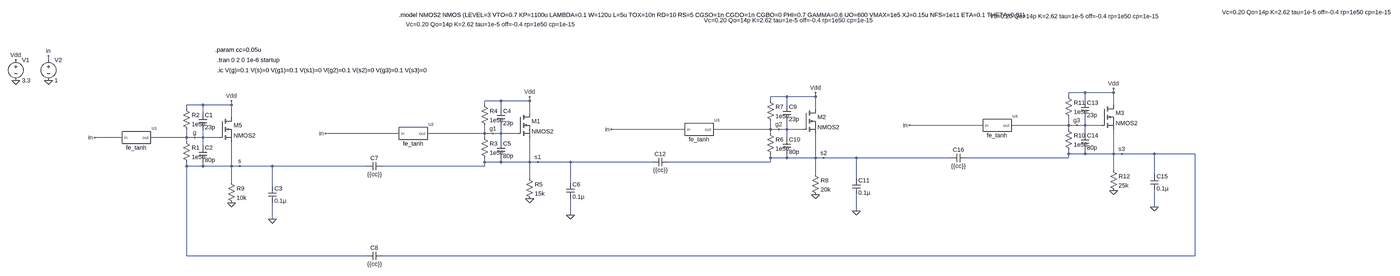
[diagram p0: schematic Oscilador_coupled_transistors_single.asc, whole sheet]
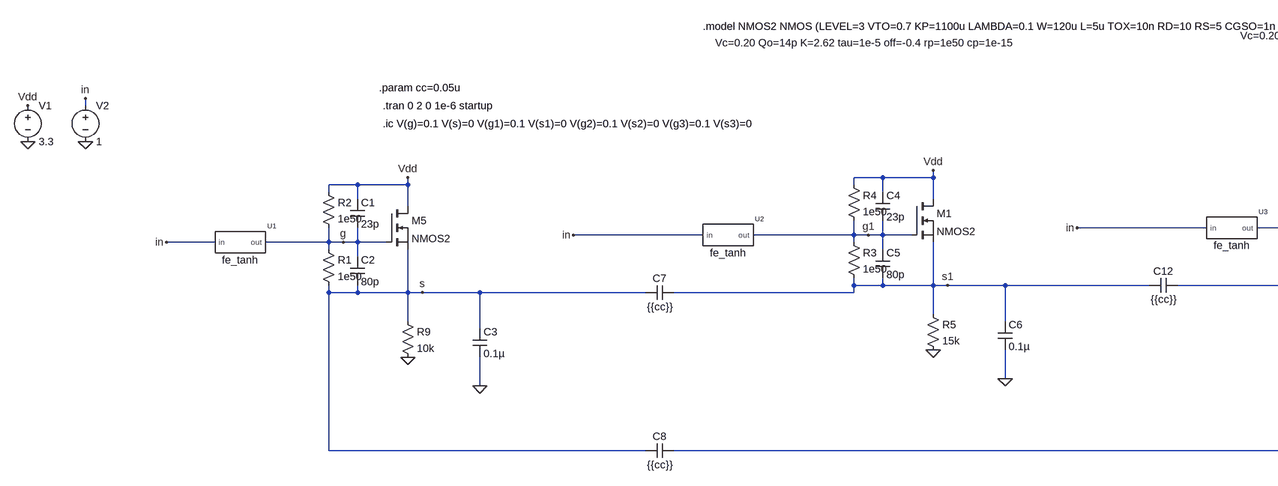
[diagram p1: schematic Oscilador_coupled_transistors_single.asc, part, row 1 of 1, column 1 of 2]
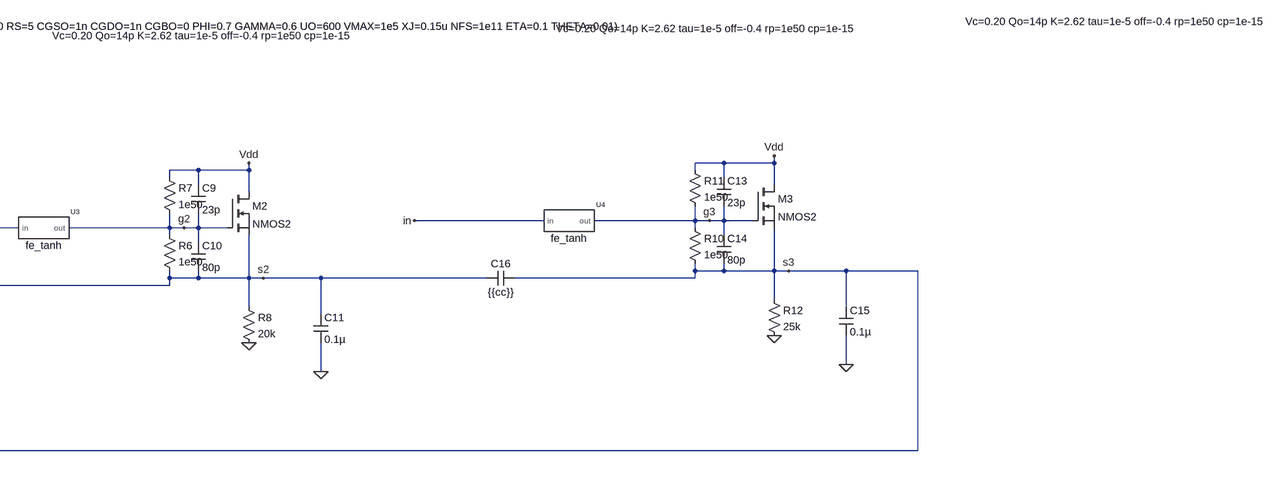
[diagram p2: schematic Oscilador_coupled_transistors_single.asc, part, row 1 of 1, column 2 of 2]
Oscilador_coupled_transistors_single.asc, the LTspice schematic file:
Version 4
SHEET 1 6256 2496
WIRE -384 -112 -384 -128
WIRE 4032 16 3968 16
WIRE 4144 16 4144 0
WIRE 4144 16 4032 16
WIRE 2864 32 2800 32
WIRE 2976 32 2976 16
WIRE 2976 32 2864 32
WIRE 3968 32 3968 16
WIRE 1744 48 1680 48
WIRE 1856 48 1856 32
WIRE 1856 48 1744 48
WIRE 2800 48 2800 32
WIRE 4032 48 4032 16
WIRE 576 64 512 64
WIRE 688 64 688 48
WIRE 688 64 576 64
WIRE 1680 64 1680 48
WIRE 2864 64 2864 32
WIRE 4144 64 4144 16
WIRE 512 80 512 64
WIRE 1744 80 1744 48
WIRE 2976 80 2976 32
WIRE 576 96 576 64
WIRE 1856 96 1856 48
WIRE 688 112 688 64
WIRE 3632 144 3344 144
WIRE 3968 144 3968 112
WIRE 3968 144 3744 144
WIRE 4000 144 3968 144
WIRE 4032 144 4032 112
WIRE 4032 144 4000 144
WIRE 4096 144 4032 144
WIRE 2464 160 2176 160
WIRE 2800 160 2800 128
WIRE 2800 160 2576 160
WIRE 2832 160 2800 160
WIRE 2864 160 2864 128
WIRE 2864 160 2832 160
WIRE 2928 160 2864 160
WIRE 3968 160 3968 144
WIRE 1344 176 1056 176
WIRE 1680 176 1680 144
WIRE 1680 176 1456 176
WIRE 1712 176 1680 176
WIRE 1744 176 1744 144
WIRE 1744 176 1712 176
WIRE 1808 176 1744 176
WIRE 2800 176 2800 160
WIRE 4032 176 4032 144
WIRE 176 192 -112 192
WIRE 512 192 512 160
WIRE 512 192 288 192
WIRE 544 192 512 192
WIRE 576 192 576 160
WIRE 576 192 544 192
WIRE 640 192 576 192
WIRE 1680 192 1680 176
WIRE 2864 192 2864 160
WIRE 512 208 512 192
WIRE 1744 208 1744 176
WIRE 576 224 576 192
WIRE 3968 256 3968 240
WIRE 4032 256 4032 240
WIRE 4032 256 3968 256
WIRE 4144 256 4144 160
WIRE 4144 256 4032 256
WIRE 4176 256 4144 256
WIRE 4304 256 4176 256
WIRE 4496 256 4304 256
WIRE 2800 272 2800 256
WIRE 2864 272 2864 256
WIRE 2864 272 2800 272
WIRE 2976 272 2976 176
WIRE 2976 272 2864 272
WIRE 3008 272 2976 272
WIRE 3136 272 3008 272
WIRE 3504 272 3136 272
WIRE 3968 272 3968 256
WIRE 3968 272 3568 272
WIRE 1680 288 1680 272
WIRE 1744 288 1744 272
WIRE 1744 288 1680 288
WIRE 1856 288 1856 192
WIRE 1856 288 1744 288
WIRE 1888 288 1856 288
WIRE 2016 288 1888 288
WIRE 2336 288 2016 288
WIRE 2800 288 2800 272
WIRE 2800 288 2400 288
WIRE 512 304 512 288
WIRE 576 304 576 288
WIRE 576 304 512 304
WIRE 688 304 688 208
WIRE 688 304 576 304
WIRE 720 304 688 304
WIRE 848 304 720 304
WIRE 1216 304 848 304
WIRE 1680 304 1680 288
WIRE 1680 304 1280 304
WIRE 4144 320 4144 256
WIRE 2976 336 2976 272
WIRE 4304 336 4304 256
WIRE 1856 352 1856 288
WIRE 3136 352 3136 272
WIRE 688 368 688 304
WIRE 2016 368 2016 288
WIRE 848 384 848 304
WIRE 4304 464 4304 400
WIRE 3136 480 3136 416
WIRE 2016 496 2016 432
WIRE 848 512 848 448
WIRE 512 656 512 304
WIRE 1216 656 512 656
WIRE 4496 656 4496 256
WIRE 4496 656 1280 656
FLAG -512 -32 0
FLAG -512 -112 Vdd
FLAG 688 48 Vdd
FLAG 848 512 0
FLAG -384 -32 0
FLAG -112 192 in
FLAG -384 -128 in
FLAG 544 192 g
FLAG 720 304 s
FLAG 688 448 0
FLAG 1856 32 Vdd
FLAG 2016 496 0
FLAG 1056 176 in
FLAG 1712 176 g1
FLAG 1888 288 s1
FLAG 1856 432 0
FLAG 2976 16 Vdd
FLAG 3136 480 0
FLAG 2176 160 in
FLAG 2832 160 g2
FLAG 3008 272 s2
FLAG 2976 416 0
FLAG 4144 0 Vdd
FLAG 4304 464 0
FLAG 3344 144 in
FLAG 4000 144 g3
FLAG 4176 256 s3
FLAG 4144 400 0
SYMBOL voltage -512 -128 R0
WINDOW 123 0 0 Left 0
WINDOW 39 0 0 Left 0
SYMATTR InstName V1
SYMATTR Value 3.3
SYMBOL cap 560 96 R0
SYMATTR InstName C1
SYMATTR Value 23p
SYMBOL cap 560 224 R0
SYMATTR InstName C2
SYMATTR Value 80p
SYMBOL res 496 192 R0
SYMATTR InstName R1
SYMATTR Value 1e50
SYMBOL res 496 64 R0
SYMATTR InstName R2
SYMATTR Value 1e50
SYMBOL cap 832 384 R0
SYMATTR InstName C3
SYMATTR Value 0.1µ
SYMBOL voltage -384 -128 R0
WINDOW 123 0 0 Left 0
WINDOW 39 0 0 Left 0
SYMATTR InstName V2
SYMATTR Value 1
SYMBOL fe_tanh 224 192 R0
WINDOW 39 1480 -459 Top 2
SYMATTR SpiceLine Vc=0.20 Qo=14p K=2.62 tau=1e-5 off=-0.4 rp=1e50 cp=1e-15
SYMATTR InstName U1
SYMBOL nmos 640 112 R0
SYMATTR InstName M5
SYMATTR Value NMOS2
SYMBOL res 672 352 R0
SYMATTR InstName R9
SYMATTR Value 10k
SYMBOL cap 1728 80 R0
SYMATTR InstName C4
SYMATTR Value 23p
SYMBOL cap 1728 208 R0
SYMATTR InstName C5
SYMATTR Value 80p
SYMBOL res 1664 176 R0
SYMATTR InstName R3
SYMATTR Value 1e50
SYMBOL res 1664 48 R0
SYMATTR InstName R4
SYMATTR Value 1e50
SYMBOL cap 2000 368 R0
SYMATTR InstName C6
SYMATTR Value 0.1µ
SYMBOL fe_tanh 1392 176 R0
WINDOW 39 1480 -459 Top 2
SYMATTR SpiceLine Vc=0.20 Qo=14p K=2.62 tau=1e-5 off=-0.4 rp=1e50 cp=1e-15
SYMATTR InstName U2
SYMBOL nmos 1808 96 R0
SYMATTR InstName M1
SYMATTR Value NMOS2
SYMBOL res 1840 336 R0
SYMATTR InstName R5
SYMATTR Value 15k
SYMBOL cap 1280 288 R90
WINDOW 0 0 32 VBottom 2
WINDOW 3 32 32 VTop 2
SYMATTR InstName C7
SYMATTR Value {{cc}}
SYMBOL cap 1280 640 R90
WINDOW 0 0 32 VBottom 2
WINDOW 3 32 32 VTop 2
SYMATTR InstName C8
SYMATTR Value {{cc}}
SYMBOL cap 2848 64 R0
SYMATTR InstName C9
SYMATTR Value 23p
SYMBOL cap 2848 192 R0
SYMATTR InstName C10
SYMATTR Value 80p
SYMBOL res 2784 160 R0
SYMATTR InstName R6
SYMATTR Value 1e50
SYMBOL res 2784 32 R0
SYMATTR InstName R7
SYMATTR Value 1e50
SYMBOL cap 3120 352 R0
SYMATTR InstName C11
SYMATTR Value 0.1µ
SYMBOL fe_tanh 2512 160 R0
WINDOW 39 1480 -459 Top 2
SYMATTR SpiceLine Vc=0.20 Qo=14p K=2.62 tau=1e-5 off=-0.4 rp=1e50 cp=1e-15
SYMATTR InstName U3
SYMBOL nmos 2928 80 R0
SYMATTR InstName M2
SYMATTR Value NMOS2
SYMBOL res 2960 320 R0
SYMATTR InstName R8
SYMATTR Value 20k
SYMBOL cap 2400 272 R90
WINDOW 0 0 32 VBottom 2
WINDOW 3 32 32 VTop 2
SYMATTR InstName C12
SYMATTR Value {{cc}}
SYMBOL cap 4016 48 R0
SYMATTR InstName C13
SYMATTR Value 23p
SYMBOL cap 4016 176 R0
SYMATTR InstName C14
SYMATTR Value 80p
SYMBOL res 3952 144 R0
SYMATTR InstName R10
SYMATTR Value 1e50
SYMBOL res 3952 16 R0
SYMATTR InstName R11
SYMATTR Value 1e50
SYMBOL cap 4288 336 R0
SYMATTR InstName C15
SYMATTR Value 0.1µ
SYMBOL fe_tanh 3680 144 R0
WINDOW 39 1480 -459 Top 2
SYMATTR SpiceLine Vc=0.20 Qo=14p K=2.62 tau=1e-5 off=-0.4 rp=1e50 cp=1e-15
SYMATTR InstName U4
SYMBOL nmos 4096 64 R0
SYMATTR InstName M3
SYMATTR Value NMOS2
SYMBOL res 4128 304 R0
SYMATTR InstName R12
SYMATTR Value 25k
SYMBOL cap 3568 256 R90
WINDOW 0 0 32 VBottom 2
WINDOW 3 32 32 VTop 2
SYMATTR InstName C16
SYMATTR Value {{cc}}
TEXT 632 -72 Left 2 !.ic V(g)=0.1 V(s)=0 V(g1)=0.1 V(s1)=0 V(g2)=0.1 V(s2)=0 V(g3)=0.1 V(s3)=0
TEXT 632 -112 Left 2 !.tran 0 2 0 1e-6 startup
TEXT 624 -152 Left 2 !.param cc=0.05u
TEXT 1344 -288 Left 2 !.model NMOS2 NMOS (LEVEL=3 VTO=0.7 KP=1100u LAMBDA=0.1 W=120u L=5u TOX=10n RD=10 RS=5 CGSO=1n CGDO=1n CGBO=0 PHI=0.7 GAMMA=0.6 UO=600 VMAX=1e5 XJ=0.15u NFS=1e11 ETA=0.1 THETA=0.01)

The netlist it stands for:
* Oscilador_coupled_transistors_single.asc
V1 Vdd 0 3.3
C1 Vdd g 23p
C2 g s 80p
R1 g s 1e50
R2 Vdd g 1e50
C3 s 0 0.1µ
V2 in 0 1
XU1 in g fe_tanh Vc=0.20 Qo=14p K=2.62 tau=1e-5 off=-0.4 rp=1e50 cp=1e-15  ; pins in out
M5 Vdd g s s NMOS2
R9 s 0 10k
C4 Vdd g1 23p
C5 g1 s1 80p
R3 g1 s1 1e50
R4 Vdd g1 1e50
C6 s1 0 0.1µ
XU2 in g1 fe_tanh Vc=0.20 Qo=14p K=2.62 tau=1e-5 off=-0.4 rp=1e50 cp=1e-15  ; pins in out
M1 Vdd g1 s1 s1 NMOS2
R5 s1 0 15k
C7 s1 s {{cc}}
C8 s3 s {{cc}}
C9 Vdd g2 23p
C10 g2 s2 80p
R6 g2 s2 1e50
R7 Vdd g2 1e50
C11 s2 0 0.1µ
XU3 in g2 fe_tanh Vc=0.20 Qo=14p K=2.62 tau=1e-5 off=-0.4 rp=1e50 cp=1e-15  ; pins in out
M2 Vdd g2 s2 s2 NMOS2
R8 s2 0 20k
C12 s2 s1 {{cc}}
C13 Vdd g3 23p
C14 g3 s3 80p
R10 g3 s3 1e50
R11 Vdd g3 1e50
C15 s3 0 0.1µ
XU4 in g3 fe_tanh Vc=0.20 Qo=14p K=2.62 tau=1e-5 off=-0.4 rp=1e50 cp=1e-15  ; pins in out
M3 Vdd g3 s3 s3 NMOS2
R12 s3 0 25k
C16 s3 s2 {{cc}}
.model NMOS NMOS
.model PMOS PMOS
.lib standard.mos
.ic V(g)=0.1 V(s)=0 V(g1)=0.1 V(s1)=0 V(g2)=0.1 V(s2)=0 V(g3)=0.1 V(s3)=0
.tran 0 2 0 1e-6 startup
.param cc=0.05u
.model NMOS2 NMOS (LEVEL=3 VTO=0.7 KP=1100u LAMBDA=0.1 W=120u L=5u TOX=10n RD=10 RS=5 CGSO=1n CGDO=1n CGBO=0 PHI=0.7 GAMMA=0.6 UO=600 VMAX=1e5 XJ=0.15u NFS=1e11 ETA=0.1 THETA=0.01)
.lib ./fe_tanh_ni.sp
.backanno
.end